# EAGLE design VentaConnected_Arduino_V0.01_2017-11-21_VorAutoRouting (EAGLE 8.3.2)
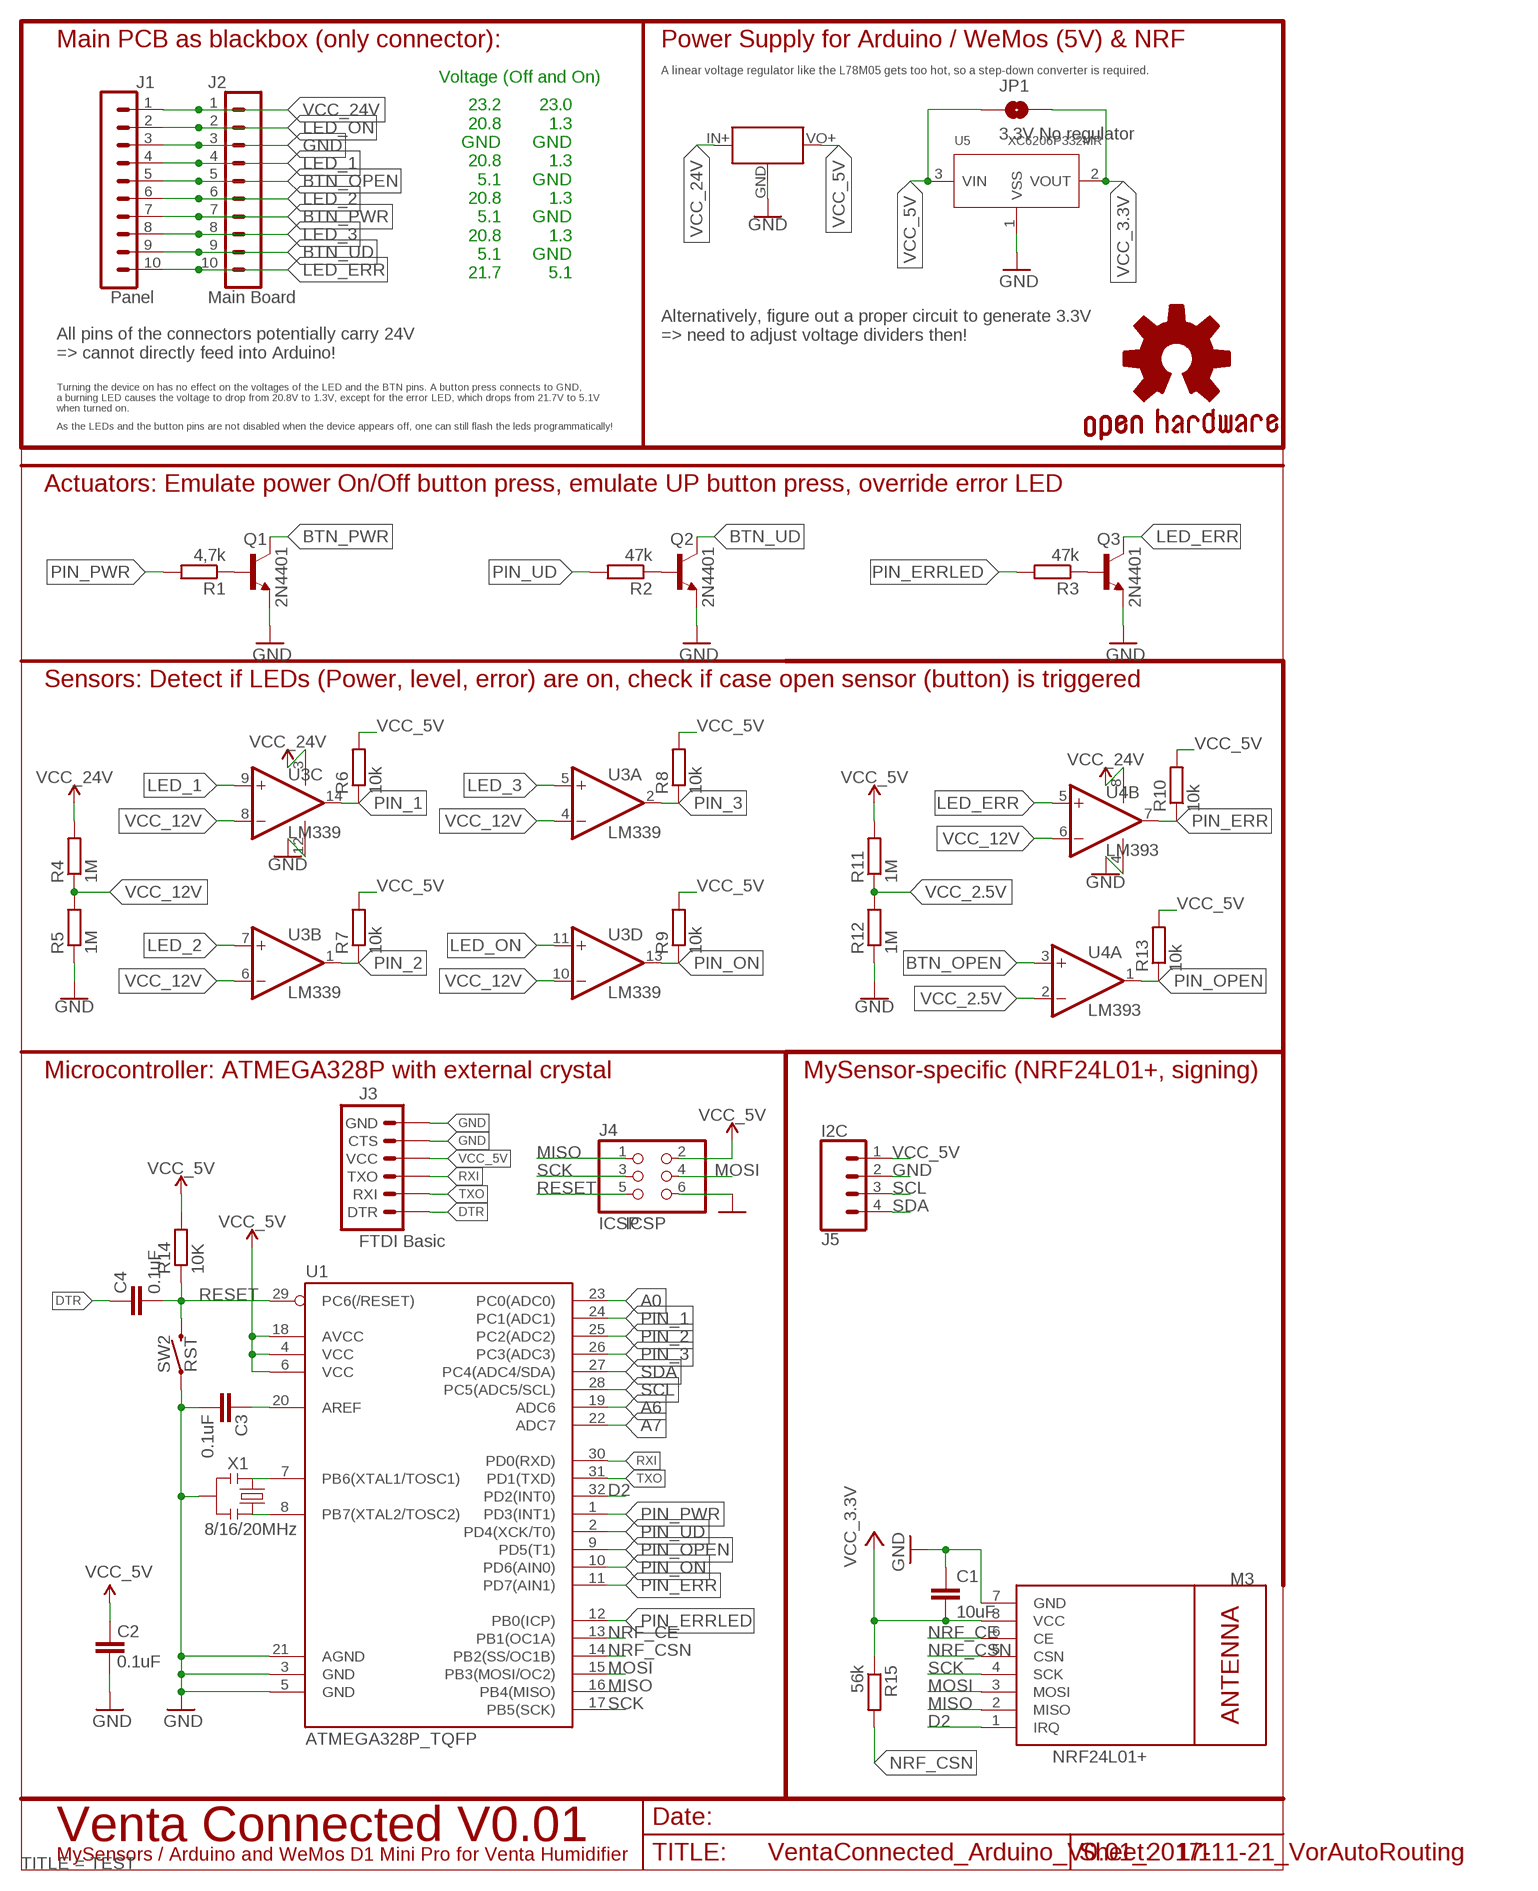
[diagram p0: schematic, sheet 1]
FRAME3 (A4-SMALL-DOCFIELD): TITLE: TEST

## Parts
C1  10uF  C-EUC0805  [C0805]
C2  0.1uF  CAP0805  [0805]
C3  0.1uF  CAP0805  [0805]
C4  0.1uF  CAP0805  [0805]
GOLD_ORB_SM1  OSHWLOGO_GOLD_ORB_SM  [OSHW2]
J1  Panel  CONN_05X2SHD  [2X5-SHROUDED]
J2  Main Board  CONN_05X2PTH  [2X5]
J3  FTDI Basic  ARDUINO_SERIAL_PROGRAMPTH  [1X06]
J4  ICSP  PINHD-2X3  [2X03]
J5  I2C  CONN_04  [1X04]
JP1  3.3V No regulator  JUMPER-SMT_2_NO_SILK  [SMT-JUMPER_2_NO_SILK]
M3  NRF24L01+  WIRELESS-NRF24L01SMD  [WIRELESS-NRF24L01-SMD]
Q1  2N4401  MMBT4401LT1-NPN-SOT23-BEC  [SOT23-BEC]
Q2  2N4401  MMBT4401LT1-NPN-SOT23-BEC  [SOT23-BEC]
Q3  2N4401  MMBT4401LT1-NPN-SOT23-BEC  [SOT23-BEC]
R1  4,7k  R-EU_R0805  [R0805]
R2  47k  R-EU_R0805  [R0805]
R3  47k  R-EU_R0805  [R0805]
R4  1M  R-EU_R0805  [R0805]
R5  1M  R-EU_R0805  [R0805]
R6  10k  R-EU_R0805  [R0805]
R7  10k  R-EU_R0805  [R0805]
R8  10k  R-EU_R0805  [R0805]
R9  10k  R-EU_R0805  [R0805]
R10  10k  R-EU_R0805  [R0805]
R11  1M  R-EU_R0805  [R0805]
R12  1M  R-EU_R0805  [R0805]
R13  10k  R-EU_R0805  [R0805]
R14  10K  R-EU_R0805  [R0805]
R15  56k  R-EU_R0805  [R0805]
SW2  RST  MOMENTARY-SWITCH-SPST-SMD-6.0X3.5MM  [TACTILE_SWITCH_SMD_6.0X3.5MM]
U1  ATMEGA328P_TQFP  [TQFP32-08]
U2  MINI_BUCK_CONVERTER_UPSIDEDOWN  [MINI_BUCK_CONVERTER_UPDOWN]
U3  LM339  TLC339D  [SO14]
U4  LM393  LM393D  [SO08]
U5  XC6206P332MR  PMIC-LDO-XC6206P332MR-G(SOT23)  [SOT-23]
X1  8/16/20MHz  RESONATOR1:1  [RESONATOR-SMD-1:1]

## Nets
A0: U1.23(PC0(ADC0))
A6: U1.19(ADC6)
A7: U1.22(ADC7)
AREF: C3.2 U1.20(AREF)
BTN_OPEN: J1.5 J2.5 U4.3(A:+IN)
BTN_PWR: J1.7 J2.7 Q1.C
BTN_UD: J1.9 J2.9 Q2.C
D2: M3.1(IRQ) U1.32(PD2(INT0))
DTR: C4.2 J3.1(DTR)
GND: C1.1 C2.1 C3.1 J1.3 J2.3 J3.5(CTS) J3.6(GND) J4.6 J5.2 M3.7(GND) Q1.E Q2.E Q3.E R5.1 R12.1 SW2.1 U1.3(GND) U1.5(GND) U1.21(AGND) U2.GND U3.12(P:V-) U4.4(P:V-) U5.1(VSS) X1.2
LED_1: J1.4 J2.4 U3.9(C:+IN)
LED_2: J1.6 J2.6 U3.7(B:+IN)
LED_3: J1.8 J2.8 U3.5(A:+IN)
LED_ERR: J1.10 J2.10 Q3.C U4.5(B:+IN)
LED_ON: J1.2 J2.2 U3.11(D:+IN)
MISO: J4.1 M3.2(MISO) U1.16(PB4(MISO))
MOSI: J4.4 M3.3(MOSI) U1.15(PB3(MOSI/OC2))
N$2: Q1.B R1.1
N$5: Q3.B R3.1
N$6: Q2.B R2.1
N$12: U1.8(PB7(XTAL2/TOSC2)) X1.3
N$13: U1.7(PB6(XTAL1/TOSC1)) X1.1
NRF_CE: M3.6(CE) U1.13(PB1(OC1A))
NRF_CSN: M3.5(CSN) R15.2 U1.14(PB2(SS/OC1B))
PIN_1: R6.1 U1.24(PC1(ADC1)) U3.14(C:OUT)
PIN_2: R7.1 U1.25(PC2(ADC2)) U3.1(B:OUT)
PIN_3: R8.1 U1.26(PC3(ADC3)) U3.2(A:OUT)
PIN_ERR: R10.1 U1.11(PD7(AIN1)) U4.7(B:OUT)
PIN_ERRLED: R3.2 U1.12(PB0(ICP))
PIN_ON: R9.1 U1.10(PD6(AIN0)) U3.13(D:OUT)
PIN_OPEN: R13.1 U1.9(PD5(T1)) U4.1(A:OUT)
PIN_PWR: R1.2 U1.1(PD3(INT1))
PIN_UD: R2.2 U1.2(PD4(XCK/T0))
RESET: C4.1 J4.5 R14.1 SW2.2 U1.29(PC6(/RESET))
RXI: J3.3(TXO) U1.30(PD0(RXD))
SCK: J4.3 M3.4(SCK) U1.17(PB5(SCK))
SCL: J5.3 U1.28(PC5(ADC5/SCL))
SDA: J5.4 U1.27(PC4(ADC4/SDA))
TXO: J3.2(RXI) U1.31(PD1(TXD))
VCC_2.5V: R11.1 R12.2 U4.2(A:-IN)
VCC_3.3V: C1.2 JP1.2 M3.8(VCC) R15.1 U5.2(VOUT)
VCC_5V: C2.2 J3.4(VCC) J4.2 J5.1 JP1.1 R6.2 R7.2 R8.2 R9.2 R10.2 R11.2 R13.2 R14.2 U1.4(VCC) U1.6(VCC) U1.18(AVCC) U2.VO+(VOUT) U5.3(VIN)
VCC_12V: R4.1 R5.2 U3.4(A:-IN) U3.6(B:-IN) U3.8(C:-IN) U3.10(D:-IN) U4.6(B:-IN)
VCC_24V: J1.1 J2.1 R4.2 U2.IN+(VIN) U3.3(P:V+) U4.8(P:V+)

## Notes on the sheet
- Main PCB as blackbox (only connector): | Power Supply for Arduino / WeMos (5V) & NRF
- A linear voltage regulator like the L78M05 gets too hot, so a step-down converter is required.
- Voltage (Off and On)
- 23.2
  20.8
  GND
  20.8
  5.1
  20.8
  5.1
  20.8
  5.1
  21.7
- 23.0
  1.3
  GND
  1.3
  GND
  1.3
  GND
  1.3
  GND
  5.1
- Alternatively, figure out a proper circuit to generate 3.3V 
  => need to adjust voltage dividers then!
- All pins of the connectors potentially carry 24V 
  => cannot directly feed into Arduino!
- Turning the device on has no effect on the voltages of the LED and the BTN pins. A button press connects to GND, 
  a burning LED causes the voltage to drop from 20.8V to 1.3V, except for the error LED, which drops from 21.7V to 5.1V 
  when turned on.
- As the LEDs and the button pins are not disabled when the device appears off, one can still flash the leds programmatically!
- Actuators: Emulate power On/Off button press, emulate UP button press, override error LED
- Sensors: Detect if LEDs (Power, level, error) are on, check if case open sensor (button) is triggered
- Microcontroller: ATMEGA328P with external crystal | MySensor-specific (NRF24L01+, signing)
- ICSP
- Venta Connected V0.01
- MySensors / Arduino and WeMos D1 Mini Pro for Venta Humidifier

## Library data of the parts
C1 = rcl:C-EU: CAPACITOR, European symbol
C2-C4 = SparkFun:CAP: Capacitor Standard 0603 ceramic capacitor, and 0.1" leaded capacitor.
GOLD_ORB_SM1 = bfl:OSHWLOGO: These are Open-Source Hardware logos.
J1 = opentools-connectors:CONN_05X2: Multi connection point. Often used as Generic Header-pin footprint for 0.1 inch spaced/style header connections For AVR SPI programming port, see special device with nice symbol: "AVR_SPI_PROG_5x2.dev" You can populate with any combo of single row headers, but if you'd like an exact match, check these: 2x5 AVR ICSP Male Header <https://www.sparkfun.com/products/778> (PRT-00778) 2x5 Pin Shrouded Header <https://www.sparkfun.com/products/8506> (PRT-08506) On any of the 0.1 inch spaced packages, you can populate with these: Break Away Headers - Straight <https://www.sparkfun.com/products/116> (PRT-00116) Break Away Male Headers - Right Angle <https://www.sparkfun.com/products/553> (PRT-00553) Female Headers <https://www.sparkfun.com/products/115> (PRT-00115) Break Away Headers - Machine Pin <https://www.sparkfun.com/products/117> (PRT-00117) Break Away Female Headers - Swiss Machine Pin <https://www.sparkfun.com/products/743> (PRT-00743) Special note: the shrouded connector mates well with our 5x2 ribbon cables: 2x5 Pin IDC Ribbon Cable <https://www.sparkfun.com/products/8535> (PRT-08535); PROD_ID: CONN-08671; SF_ID: PRT-08506
J2 = opentools-connectors:CONN_05X2: Multi connection point. Often used as Generic Header-pin footprint for 0.1 inch spaced/style header connections For AVR SPI programming port, see special device with nice symbol: "AVR_SPI_PROG_5x2.dev" You can populate with any combo of single row headers, but if you'd like an exact match, check these: 2x5 AVR ICSP Male Header <https://www.sparkfun.com/products/778> (PRT-00778) 2x5 Pin Shrouded Header <https://www.sparkfun.com/products/8506> (PRT-08506) On any of the 0.1 inch spaced packages, you can populate with these: Break Away Headers - Straight <https://www.sparkfun.com/products/116> (PRT-00116) Break Away Male Headers - Right Angle <https://www.sparkfun.com/products/553> (PRT-00553) Female Headers <https://www.sparkfun.com/products/115> (PRT-00115) Break Away Headers - Machine Pin <https://www.sparkfun.com/products/117> (PRT-00117) Break Away Female Headers - Swiss Machine Pin <https://www.sparkfun.com/products/743> (PRT-00743) Special note: the shrouded connector mates well with our 5x2 ribbon cables: 2x5 Pin IDC Ribbon Cable <https://www.sparkfun.com/products/8535> (PRT-08535); PROD_ID: CONN-08499; SF_ID: PRT-0778
J3 = SparkFun:ARDUINO_SERIAL_PROGRAM
J4 = analyzer:PINHD-2X3
J5 = SparkFun-Connectors:CONN_04: Multi connection point. Often used as Generic Header-pin footprint for 0.1 inch spaced/style header connections On any of the 0.1 inch spaced packages, you can populate with these: Break Away Headers - Straight <https://www.sparkfun.com/products/116> (PRT-00116) Break Away Male Headers - Right Angle <https://www.sparkfun.com/products/553> (PRT-00553) Female Headers <https://www.sparkfun.com/products/115> (PRT-00115) Break Away Headers - Machine Pin <https://www.sparkfun.com/products/117> (PRT-00117) Break Away Female Headers - Swiss Machine Pin <https://www.sparkfun.com/products/743> (PRT-00743) For SCREWTERMINALS and SPRING TERMINALS visit here: Screw Terimnals on SparkFun.com <https://www.sparkfun.com/search/results?term=Screw+Terminals> (5mm/3.5mm/2.54mm spacing) This device is also useful as a general connection point to wire up your design to another part of your project. Our various solder wires solder well into these plated through hole pads. Hook-Up Wire - Assortment (Stranded, 22 AWG) <https://www.sparkfun.com/products/11375> (PRT-11375) Hook-Up Wire - Assortment (Solid Core, 22 AWG) <https://www.sparkfun.com/products/11367> (PRT-11367) View the entire wire category on our website here <https://www.sparkfun.com/categories/141> Special notes: Molex polarized connector foot print use with SKU : PRT-08231 with associated crimp pins and housings. 1MM SMD Version SKU: PRT-10208; PROD_ID: CONN-09696
JP1 = SparkFun-Jumpers:JUMPER-SMT_2_NO: Normally open jumper This jumper has two pads in close proximity to each other. Apply solder to close the connection. Round pads are easier to solder for beginners, but are a lot larger. SparkFun Product that uses the round pads: SparkFun EL Sequencer <https://www.sparkfun.com/products/12781>
M3 = nrf24l01plus:WIRELESS-NRF24L01: 2.4 GHz Wireless Module based on NRF24L01 chip
Q1-Q3 = transistor-neu-to92:*-NPN-: NPN Transistror
R1-R5 R11 R12 = resistor:R-EU_: RESISTOR, European symbol
R6-R10 R13-R15 = rcl:R-EU_: RESISTOR, European symbol
SW2 = SparkFun-Switches:MOMENTARY-SWITCH-SPST: Momentary Switch (Pushbutton) - SPST Normally-open (NO) SPST momentary switches (buttons, pushbuttons). Variants PTH-12MM - 12mm square, through-hole Momentary Pushbutton Switch - 12mm Square <https://www.sparkfun.com/products/9190> (COM-09190) PTH-6.0MM, PTH-6.0MM-KIT - 6.0mm square, through-hole Mini Pushbutton Switch <https://www.sparkfun.com/products/97> (COM-00097) KIT package intended for soldering kit's - only one side of pads' copper is exposed. PTH-RIGHT-ANGLE-KIT - Right-angle, through-hole Right Angle Tactile Button <https://www.sparkfun.com/products/10791> - Used on SparkFun BigTime Watch Kit <https://www.sparkfun.com/products/11734> SMD-12MM - 12mm square, surface-mount Tactile Button - SMD (12mm) <https://www.sparkfun.com/products/12993> (COM-12993) Used on SparkFun PicoBoard <https://www.sparkfun.com/products/11888> SMD-4.5MM - 4.5mm Square Trackball Switch Used on SparkFun Blackberry Trackballer Breakout <https://www.sparkfun.com/products/13169> SMD-4.6MMX2.8MM - 4.60mm x 2.80mm, surface mount Used on SparkFun SAMD21 Mini Breakout <https://www.sparkfun.com/products/13664> SMD-5.2MM, SMD-5.2-REDUNDANT - 5.2mm square, surface-mount Mini Pushbutton Switch - SMD <https://www.sparkfun.com/products/8720> (COM-08720) Used on Arduino Pro Mini <https://www.sparkfun.com/products/11114> REDUNDANT package connects both switch circuits together SMD-6.0X3.5MM - 6.0 x 3.5mm, surface mount Momentary Reset Switch SMD <https://www.sparkfun.com/products/8229> (COM-08229) SMD-6.2MM-TALL - 6.2mm square, surface mount Tactile Button - SMD (6mm) <https://www.sparkfun.com/products/12992> Used on SparkFun Digital Sandbox <https://www.sparkfun.com/products/12651> SMD-RIGHT-ANGLE - Right-angle, surface mount Used on SparkFun Block for Intel® Edison - Arduino <https://www.sparkfun.com/products/13036>; PROD_ID: SWCH-00815; SF_SKU: COM-08229
U1 = SparkFun-IC-Microcontroller:ATMEGA328P_TQFP: Popular 328P in QFP Storefront component: ATmega328 - TQFP <https://www.sparkfun.com/products/13448> (COM-13448) Datasheet <http://www.sparkfun.com/datasheets/Components/SMD/ATMega328.pdf> SparkFun Products SparkFun RedBoard - Programmed with Arduino <https://www.sparkfun.com/products/12757> (DEV-12757) Arduino Pro Mini 328 - 5V/16MHz <https://www.sparkfun.com/products/11113> (DEV-11113) Arduino Pro Mini 328 - 3.3V/8MHz <https://www.sparkfun.com/products/11114> (DEV-11114) SparkFun OpenLog <https://www.sparkfun.com/products/13712> (DEV-13712) SparkFun MicroView - OLED Arduino Module <https://www.sparkfun.com/products/12923> (DEV-12923) SparkFun Digital Sandbox <https://www.sparkfun.com/products/12651> (DEV-12651) SparkFun PicoBoard <https://www.sparkfun.com/products/11888> (WIG-11888) Arduino Fio <https://www.sparkfun.com/products/10116> (DEV-10116) LilyPad Arduino 328 Main Board <https://www.sparkfun.com/products/13342> (DEV-13342) SparkFun RedStick <https://www.sparkfun.com/products/13741> (DEV-13741) LilyPad MP3 <https://www.sparkfun.com/products/11013> (DEV-11013) LilyPad Arduino SimpleSnap <https://www.sparkfun.com/products/10941> (DEV-10941) SparkFun Stepoko <https://www.sparkfun.com/products/13899> (ROB-13899) SparkFun Geiger Counter <https://www.sparkfun.com/products/11345> (SEN-11345) SparkFun EL Sequencer <https://www.sparkfun.com/products/12781> (COM-12781) Arduino Pro 328 - 5V/16MHz <https://www.sparkfun.com/products/10915> (DEV-10915) CryptoCape <https://www.sparkfun.com/products/12773> (DEV-12773) SparkFun IR Thermometer Evaluation Board - MLX90614 <https://www.sparkfun.com/products/10740> (SEN-10740) SparkFun RedBot Mainboard <https://www.sparkfun.com/products/12097> (ROB-12097) Arduino Pro 328 - 3.3V/8MHz <https://www.sparkfun.com/products/10914> (DEV-10914) SparkFun Block for Intel® Edison - Arduino <https://www.sparkfun.com/products/13036> (DEV-13036) SparkFun Simon Says - Surface Mount Soldering Kit <https://www.sparkfun.com/products/10935> (KIT-10935) SparkFun 7-Segment Serial Display - Red <https://www.sparkfun.com/products/11441> (COM-11441) SparkFun 7-Segment Serial Display - White <https://www.sparkfun.com/products/11629> (COM-11629) SparkFun 7-Segment Serial Display - Yellow <https://www.sparkfun.com/products/11443> (COM-11443) SparkFun 7-Segment Serial Display - Kelly Green <https://www.sparkfun.com/products/11440> (COM-11440) SparkFun 7-Segment Serial Display - Blue <https://www.sparkfun.com/products/11442> (COM-11442) SparkFun OpenSegment Serial Display - 20mm (Blue) <https://www.sparkfun.com/products/11647> (COM-11647) SparkFun OpenSegment Serial Display - 20mm (Green) <https://www.sparkfun.com/products/11646> (COM-11646) SparkFun OpenSegment Serial Display - 20mm (White) <https://www.sparkfun.com/products/11648> (COM-11648) SparkFun OpenSegment Serial Display - 20mm (Red) <https://www.sparkfun.com/products/11644> (COM-11644) SparkFun OpenSegment Serial Display - 20mm (Yellow) <https://www.sparkfun.com/products/11645> (COM-11645) SparkFun OpenSegment Shield <https://www.sparkfun.com/products/13190> (DEV-13190); PROD_ID: IC-09069
U2 = opentools-sensors:MINI_BUCK_CONVERTER: 4.5-40V Step Down Buck Converter
U3 = linear:TLC339: COMPARATOR
U4 = linear:LM393: COMPARATOR
U5 = Seeed-IC:PMIC-LDO-XC6206P332MR-G(SOT23): 310030099; MPN: XC6206P332MR-G; VALUE: XC6206P332MR-G-SOT23
X1 = Testing:RESONATOR: Resonator Small SMD resonator. This is the itty bitty 10/20MHz resonators with built in caps. CSTCE10M0G55 and CSTCE20M0V53. Footprint for SMD has been used in SFE production for years, and does work okay. 1:1 is an attempt to get larger fillets on the sides so it will be easier to inspect these solders in our AOI machine. The pads have been minimized to match the actual metal under the resonator. To see this relation, it includes an image import of the bottom side of the component. Imported to scale on layer 200.

## Net classes
0 default: width 0.203 mm
1 vcc: width 0.254 mm

## Board
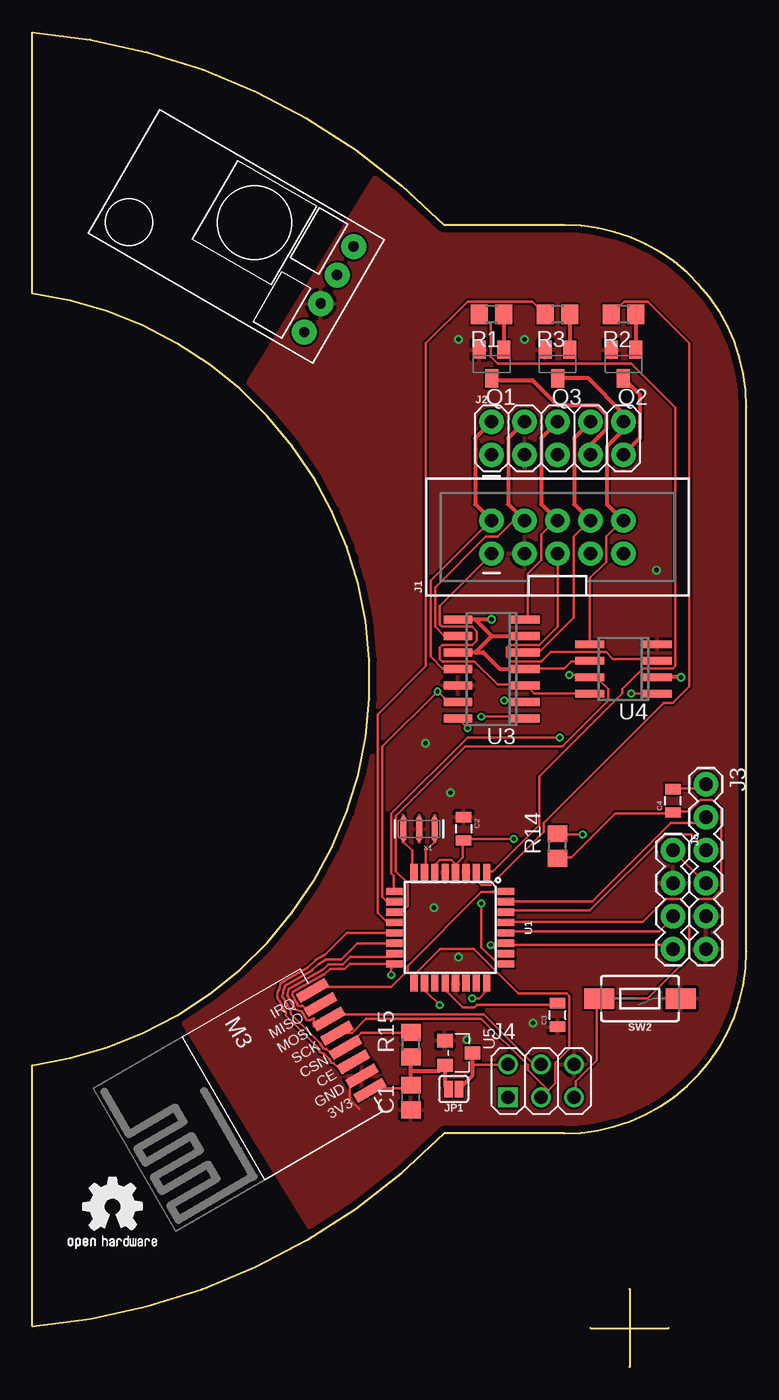
[diagram p1: board, top side]
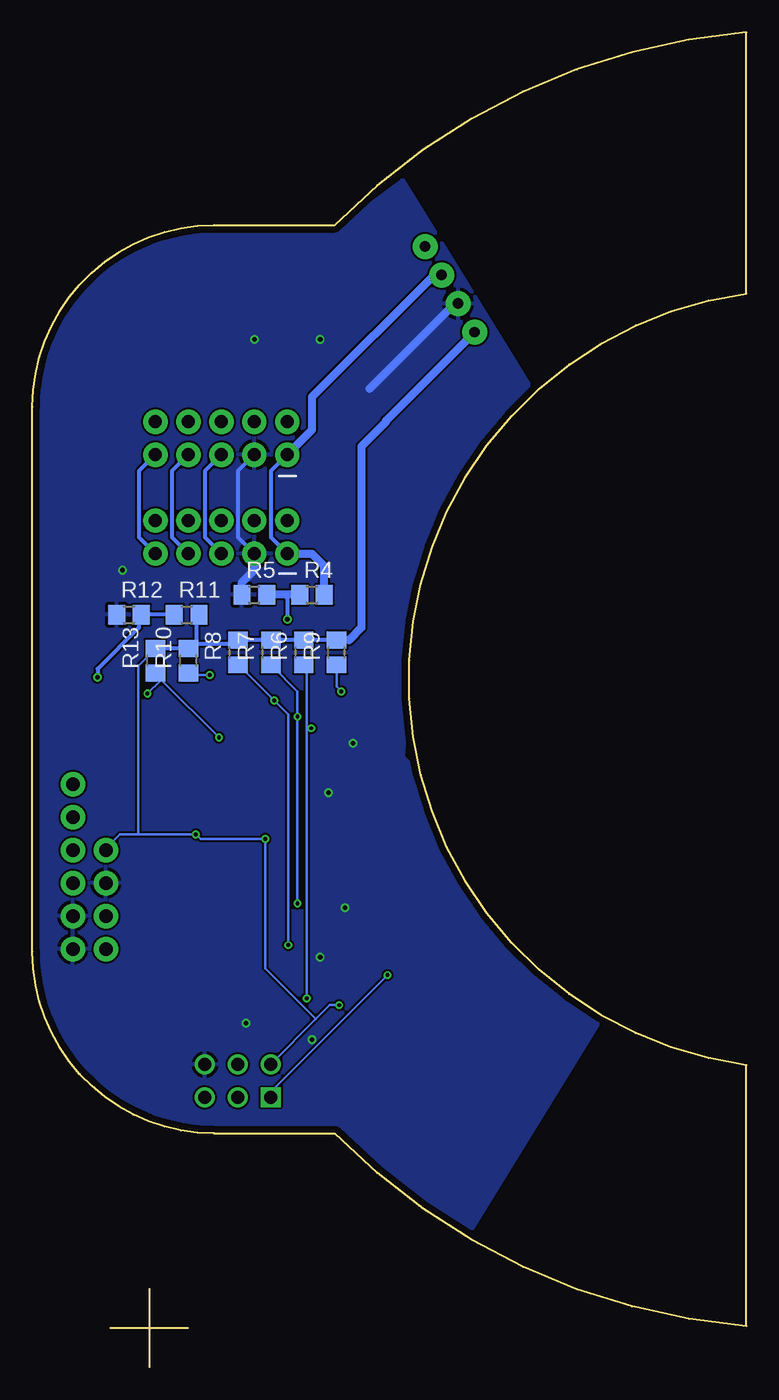
[diagram p2: board, bottom side, seen from below]

Size 55 x 102.85 mm. Coordinates in mm from the lower left corner, seen from the top.
Outline: 46,6 46,0
Outline: 43,3 49,3
Outline: 41,18 arc90 55,32 55,74 arc90 41,88 31.71,88 arc41 0,102.85 0,82.73 arc-165 0,23.27 0,3.16 arc41 31.71,18 41,18
Copper layers (1*16): Top 0.035mm / dielectric 1.6mm / Bottom 0.035mm
Design rules "Elecrow_2-layer_PCB_eagle_rule": minimum track width 6mil, minimum drill 12mil, track to track 6mil, track to pad 6mil, pad to pad 6mil, via to via 8mil, smd to smd 0mil, copper to edge 20mil, drill to drill 10mil, minimum pad ring 6mil, minimum via ring 6mil, stop-mask expansion 0mil, vias tented up to drill 100mil, thermal gap 10mil

### Footprints (pad centres in the part's own frame; a part is rotated, then mirrored left to right if it is on the bottom)
C0805 = smd 1.3 x 1.5: 1 -0.95,0; 2 0.95,0
0805 = smd 0.8 x 1.2: 1 -0.9,0; 2 0.9,0
2X5-SHROUDED = drill 1.016 pad 1.88: 1 -1.27,5.08; 2 1.27,5.08; 3 -1.27,2.54; 4 1.27,2.54; 5 -1.27,0; 6 1.27,0; 7 -1.27,-2.54; 8 1.27,-2.54; 9 -1.27,-5.08; 10 1.27,-5.08
2X5 = drill 1.016 pad 1.88: 1 0,0; 2 0,2.54; 3 2.54,0; 4 2.54,2.54; 5 5.08,0; 6 5.08,2.54; 7 7.62,0; 8 7.62,2.54; 9 10.16,0; 10 10.16,2.54
1X06 = drill 1.016 pad 1.88: 1 0,0; 2 2.54,0; 3 5.08,0; 4 7.62,0; 5 10.16,0; 6 12.7,0
2X03 = drill 1.016 square: 1 -2.54,-1.27 | drill 1.016: 2 -2.54,1.27; 3 0,-1.27; 4 0,1.27; 5 2.54,-1.27; 6 2.54,1.27
1X04 = drill 1.016 pad 1.88: 1 0,0; 2 2.54,0; 3 5.08,0; 4 7.62,0
SMT-JUMPER_2_NO_SILK = smd 0.635 x 1.27: 1 -0.406,0; 2 0.406,0
WIRELESS-NRF24L01-SMD = smd 2.54 x 0.762: 1 1.27,0; 2 1.27,1.27; 3 1.27,2.54; 4 1.27,3.81; 5 1.27,5.08; 6 1.27,6.35; 7 1.27,7.62; 8 1.27,8.89
SOT23-BEC = smd 1 x 1.4: B -0.95,-1.1; C 0,1.1; E 0.95,-1.1
R0805 = smd 1.3 x 1.5: 1 -0.95,0; 2 0.95,0
TACTILE_SWITCH_SMD_6.0X3.5MM = smd 2.3 x 1.6: 1 -3.15,0; 2 3.15,0
TQFP32-08 = smd 1.27 x 0.559: 1 -4.293,2.8; 2 -4.293,2; 3 -4.293,1.2; 4 -4.293,0.4; 5 -4.293,-0.4; 6 -4.293,-1.2; 7 -4.293,-2; 8 -4.293,-2.8; 17 4.293,-2.8; 18 4.293,-2; 19 4.293,-1.2; 20 4.293,-0.4; 21 4.293,0.4; 22 4.293,1.2; 23 4.293,2; 24 4.293,2.8 | smd 0.559 x 1.27: 9 -2.8,-4.293; 10 -2,-4.293; 11 -1.2,-4.293; 12 -0.4,-4.293; 13 0.4,-4.293; 14 1.2,-4.293; 15 2,-4.293; 16 2.8,-4.293; 25 2.8,4.293; 26 2,4.293; 27 1.2,4.293; 28 0.4,4.293; 29 -0.4,4.293; 30 -1.2,4.293; 31 -2,4.293; 32 -2.8,4.293
MINI_BUCK_CONVERTER_UPDOWN = drill 0.8 pad 1.93: EN -1.27,1.27; GND -6.35,1.27; IN+ -3.81,1.27; VO+ -8.89,1.27
SO14 = smd 0.6 x 2.2: 1 -3.81,-2.6; 2 -2.54,-2.6; 3 -1.27,-2.6; 4 0,-2.6; 5 1.27,-2.6; 6 2.54,-2.6; 7 3.81,-2.6; 8 3.81,2.6; 9 2.54,2.6; 10 1.27,2.6; 11 0,2.6; 12 -1.27,2.6; 13 -2.54,2.6; 14 -3.81,2.6
SO08 = smd 0.6 x 2.2: 1 -1.905,-2.6; 2 -0.635,-2.6; 3 0.635,-2.6; 4 1.905,-2.6; 5 1.905,2.6; 6 0.635,2.6; 7 -0.635,2.6; 8 -1.905,2.6
SOT-23 = smd 1.016 x 1.2: 1 -0.95,-1.06; 2 0.95,-1.06; 3 0,1.06
RESONATOR-SMD-1:1 = smd 0.45 x 1.905: 1 -1.2,0; 2 0,0; 3 1.2,0

### Placement (x,y rotation side)
C1  29.15,20.78 90 top
C2  33.21,41.48 270 top
C3  40.45,27.13 90 top
C4  49.34,43.64 90 top
GOLD_ORB_SM1  2.35,8.08 0 top
J1  40.45,63.96 90 top
J2  35.37,70.31 0 top
J3  51.88,44.91 270 top
J4  39.18,22.05 0 top
J5  49.34,39.83 270 top
JP1  32.45,21.41 180 top
M3  22.67,29.67 210 top
Q1  35.37,77.3 180 top
Q2  45.53,77.3 180 top
Q3  40.45,77.3 180 top
R1  35.37,81.11 180 top
R2  45.53,81.11 180 top
R3  40.45,81.11 180 top
R4  33.47,59.52 0 bottom
R5  37.91,59.52 0 bottom
R6  34.1,55.07 90 bottom
R7  36.64,55.07 90 bottom
R8  39.18,55.07 90 bottom
R9  31.56,55.07 90 bottom
R10  42.99,54.44 90 bottom
R11  43.12,57.99 0 bottom
R12  47.56,57.99 0 bottom
R13  45.53,54.44 90 bottom
R14  40.45,40.15 90 top
R15  29.15,24.84 90 top
SW2  46.8,28.4 180 top
U1  32.2,33.86 270 top
U2  26.48,86.82 60 top
U3  35.37,53.8 90 top
U4  45.53,53.8 90 top
U5  32.83,24.21 270 top
X1  29.78,41.48 180 top

### Tracks (layer width: path | path; a pad name or v marks a point on that pad's centre or on a via)
AREF
  Top 0.203: C3.2 40.45,27.89 34.23,27.89 34.05,27.71 33.16,27.71 31.92,28.96 31.92,29.49 U1.20
BTN_OPEN
  Top 0.203: J1.5 40.45,57.05 39.03,55.63 36.72,55.63 36.54,55.45 36.54,54.74 36.89,54.38 39.2,54.38 39.92,55.09 44.18,55.09 44.72,54.56 48.09,54.56 U4.3
  Bottom 0.305: J2.5 41.72,69.04 41.72,63.96 J1.5
BTN_PWR
  Top 0.305: Q1.C 35.54,76.03 38.55,76.03 40.48,74.09 43.51,74.09 44.23,73.37 44.23,72.33 42.99,71.09 J2.7
  Bottom 0.305: J2.7 44.26,69.04 44.26,63.96 J1.7
BTN_UD
  Top 0.305: 45.53,76.03 Q2.C 46.8,74.92 46.8,71.58 J2.9
  Bottom 0.305: J2.9 46.8,69.04 46.8,63.96 J1.9
D2
  Top 0.203: U1.32 36.36,36.6 34.58,36.6 28.89,30.91 28.89,30.56 27.65,29.31 21.78,29.31 21.6,29.14 M3.1
DTR
  Top 0.203: C4.2 49.34,44.6 51.65,44.6 51.83,44.78 J3.1
GND  (via drill 0.35)
  Top 0.203: 25.52,22.56 M3.7 25.34,22.38 24.45,21.49 24.45,20.6 25.16,19.89 | 49.87,28.25 SW2.1 | 29.07,19.89 C1.1
  Bottom 0.305: J2.3 39.18,69.04 39.18,63.96 J1.3
  Bottom 0.61: U2.GND 22.45,81.96 29.02,75.39 | J1.3 37.91,61.42 38.86,60.47 R5.1
  other vias: 32.83,79.2 37.91,79.2 48.07,61.42 32.83,31.57 33.47,25.23 38.55,26.5 30.92,35.38 32.2,44.27 30.29,48.09
  pour Top: 26.48,91.9 16.32,75.39 16.32,74.12 22.67,67.77 21.4,66.5 25.21,62.69 26.48,47.45 25.21,46.18 22.67,38.56 11.24,27.13 21.4,10.62 32.83,18.24 44.26,18.24 53.15,23.32 55.69,29.67 55.69,74.12 51.88,84.28 42.99,88.09 31.56,88.09
  pour Bottom: 26.48,91.52 16.32,75.01 16.32,73.74 22.67,67.39 21.4,66.12 25.21,62.31 26.48,47.07 25.21,45.8 22.67,38.18 11.24,26.75 21.4,10.24 32.83,17.86 44.26,17.86 53.15,22.94 55.69,29.29 55.69,73.74 51.88,83.9 42.99,87.71 31.56,87.71
LED_1
  Top 0.203: U3.9 31.74,56.34 31.03,57.05 31.03,60.07 34.94,63.98 35.83,63.98 37.43,65.59 J1.4
  Top 0.305: J2.4 36.64,71.58 36.64,66.5 J1.4
LED_2
  Top 0.203: U3.7 38.14,57.76 38.14,61.14 39.2,62.21 39.2,64.16 40.27,65.23 J1.6
  Top 0.305: J2.6 39.18,71.58 39.18,66.5 J1.6
LED_3
  Top 0.203: U3.5 38.14,55.09 39.03,55.09 41.7,57.76 41.7,63.98 42.94,65.23 J1.8
  Top 0.305: J2.8 41.72,71.58 41.72,66.5 J1.8
LED_ERR
  Top 0.203: U4.5 42.94,55.81 42.94,60.78 44.18,62.03 44.18,63.98 45.43,65.23 J1.10
  Top 0.305: J1.10 44.26,66.5 44.26,70.94 45.53,72.22 J2.10 45.53,73.48 42.82,76.19 Q3.C
LED_ON
  Top 0.203: U3.11 32.63,53.85 31.56,53.85 30.67,54.74 30.67,60.61 35.29,65.23 J1.2
  Top 0.305: J2.2 34.1,71.58 34.1,66.5 J1.2
MISO  (via drill 0.3)
  Top 0.203: 20.34,28.12 20.01,28.69 20.06,28.9 22.44,30.27 22.5,30.26 22.92,30.69 24.07,30.69 24.44,31.06 U1.16 27.65,31.09 v27.65,30.2 | 20.34,28.12 | 20.34,28.12 20.49,27.85 20.7,27.8 20.8,27.86 21.4,27.26 21.53,27.26 M3.2
  Bottom 0.203: v27.65,30.2 36.54,21.31 36.54,20.78 J4.1
MOSI
  Top 0.203: 20.26,27.55 20.46,27.49 20.48,27.47 20.75,27.4 21.13,26.75 21.33,26.7 21.65,26.88 21.65,26.24 22.25,26.84 M3.3 22.85,27 23.03,27.18 34.76,27.18 38.49,23.45 39.03,23.45 J4.4 | 20.26,27.55 | 20.26,27.55 | 20.26,27.55 20.11,27.8 20.05,27.9 19.98,27.97 19.98,28.02 19.96,28.07 19.77,28.39 | 19.77,28.39 | 19.77,28.39 19.63,28.64 | 19.63,28.64 | 19.63,28.64 | 19.63,28.64 19.68,28.85 | 19.68,28.85 | 19.68,28.85 19.76,29.13 21.77,30.3 21.78,30.3 22.39,30.66 22.78,31.04 23.92,31.04 24.47,31.59 27.64,31.59 U1.15
N$2
  Top 0.305: R1.1 Q1.B
N$5
  Top 0.305: R3.1 Q3.B
N$6
  Top 0.305: R2.1 Q2.B
N$12
  Top 0.203: U1.8 29.25,38.2 29.25,39.8 28.54,40.52 28.58,40.47
N$13
  Top 0.203: U1.7 30.31,38.2 30.31,39.8 31.03,40.52 30.98,40.47
NRF_CE
  Top 0.203: 21.17,30.77 | 21.17,30.77 | 21.17,30.77 19.53,29.82 19.36,29.72 19.3,29.72 19.23,29.65 19.15,29.6 19.13,29.55 19.09,29.51 19.09,29.48 19.04,29.27 19.02,29.16 18.99,29.01 18.91,28.94 18.86,28.77 18.86,28.59 18.87,28.57 18.86,28.54 18.87,28.53 18.86,28.49 18.89,28.45 18.89,28.39 18.96,28.26 19.06,28.17 19.1,28.09 19.11,28.08 19.12,28.06 | 19.12,28.06 | 19.12,28.06 | 19.12,28.06 19.13,28.06 19.19,27.88 | 19.19,27.88 | 19.19,27.88 | 21.17,30.77 21.26,30.82 21.78,31.35 21.87,31.4 22.48,31.75 22.53,31.78 24.21,33.46 U1.13 | 19.19,27.88 19.27,27.75 19.27,27.68 19.48,27.46 19.53,27.39 19.53,27.09 21.87,24.75 22.02,24.5 22.16,24.25 | 22.16,24.25 | 22.16,24.25 22.37,24.19 | 22.37,24.19 | 22.37,24.19 22.46,24.17 22.84,23.78 23.03,23.45 23.22,23.4 23.94,22.68 23.94,22.73 M3.6
NRF_CSN
  Top 0.203: U1.14 25.04,32.66 23.77,31.4 22.63,31.4 22.02,31.04 21.56,30.59 21.48,30.54 21.47,30.53 19.71,29.51 19.45,29.37 | 19.45,29.37 | 19.45,29.37 | 19.45,29.37 19.43,29.27 19.37,29.07 19.36,29.06 19.33,28.93 19.31,28.83 19.27,28.79 19.27,28.7 19.24,28.62 19.25,28.61 19.24,28.59 19.24,28.54 19.27,28.5 19.33,28.43 19.37,28.35 19.39,28.35 19.39,28.34 | 19.39,28.34 19.45,28.24 19.48,28.14 19.52,28.12 19.58,28.02 19.63,27.93 19.63,27.82 19.77,27.68 19.9,27.45 19.9,27.23 22.15,24.98 22.4,24.55 22.6,24.5 22.62,24.51 23.18,23.95 23.43,23.95 M3.5 24.27,24.69 25.34,25.76 29.07,25.76 R15.2 | 19.39,28.34 | 19.39,28.34
PIN_1  (via drill 0.3)
  Top 0.203: v33.87,28.43 34.41,28.43 34.94,28.96 34.94,29.49 U1.24 | v33.52,49.23 32.8,49.94 U3.14
  Bottom 0.203: 33.87,49.23 33.87,53.85 34.05,54.03 R6.1 | 33.87,49.23 v33.87,28.43 | 33.87,49.23 v33.52,49.23
PIN_2  (via drill 0.3)
  Top 0.203: v34.58,35.72 34.58,32.34 35.83,31.09 36.36,31.09 U1.25 | v34.58,50.12 37.96,50.12 U3.1
  Bottom 0.203: v34.58,35.72 v34.58,50.12 34.58,52.07 36.54,54.03 R7.1
PIN_3  (via drill 0.3)
  Top 0.203: v35.29,32.52 35.83,31.98 36.36,31.98 U1.26 | v36.36,51.36 37.96,51.36 U3.2
  Bottom 0.203: v35.29,32.52 35.29,50.3 v36.36,51.36 39.03,54.03 R8.1
PIN_ERR  (via drill 0.3)
  Top 0.203: U1.11 28,35.18 28.54,35.18 28.89,35.54 28.89,37.31 28,38.2 28,42.47 33.34,47.81 40.81,47.81 44.36,51.36 44.36,52.25 43.47,53.14 42.94,53.14 U4.7 42.76,53.32 v41.34,53.32
  Bottom 0.203: v41.34,53.32 42.94,53.32 R10.1
PIN_ERRLED
  Top 0.203: U1.12 27.83,34.29 27.29,34.29 26.58,35 26.58,50.3 30.31,54.03 30.31,78.92 33.52,82.12 38.49,82.12 39.38,81.23 R3.2
PIN_ON  (via drill 0.3)
  Top 0.203: 32.09,51.18 32.63,51.18 U3.13 32.09,51.18 | U1.10 27.83,35.89 27.29,35.89 26.94,36.25 26.94,47.81 v31.2,52.07 32.09,51.18
  Bottom 0.203: R9.1 31.56,52.43 v31.2,52.07
PIN_OPEN  (via drill 0.3)
  Top 0.203: v40.63,48.52 33.52,48.52 27.65,42.65 27.65,38.03 27.83,37.85 27.83,36.78 U1.9 | v46.14,51.9 U4.1
  Bottom 0.203: 45.07,52.96 45.43,53.32 R13.1 45.07,52.96 | 45.07,52.96 v40.63,48.52 | 45.07,52.96 v46.14,51.9
PIN_PWR
  Top 0.203: U1.1 35.12,38.2 35.47,38.2 39.03,41.76 39.03,45.49 45.43,51.9 45.43,52.25 47.03,53.85 49.34,53.85 49.52,54.03 49.52,73.94 46.14,77.32 35.83,77.32 35.29,77.85 35.29,80.34 34.58,81.05 R1.2
PIN_UD
  Top 0.203: U1.2 34.23,38.03 34.23,37.49 34.58,37.14 35.29,37.14 39.38,41.23 39.38,41.94 48.63,51.18 49.34,51.18 50.59,52.43 50.59,78.92 47.38,82.12 45.61,82.12 44.72,81.23 R2.2
RESET
  Top 0.203: R14.1 40.45,39.27 41.52,39.27 44.9,42.65 49.34,42.65 C4.1 49.34,42.83 50.59,42.83 51.47,43.72 52.36,43.72 53.07,43.01 53.07,36.78 52.36,36.07 51.3,36.07 50.59,35.36 | 50.59,35.36 49.87,36.07 48.81,36.07 47.03,34.29 36.54,34.29 U1.29 | 50.59,35.36 50.59,31.63 47.38,28.43 43.65,28.43 SW2.2 43.47,28.25 43.47,23.62 41.87,22.02 41.87,20.78 J4.5
RXI
  Top 0.203: U1.30 36.54,35.18 42.94,35.18 48.81,41.05 50.76,41.05 51.83,39.98 J3.3
SCK
  Top 0.203: 39.74,21.31 39.2,20.78 J4.3 | 39.74,21.31 40.27,21.85 40.27,23.45 41.34,24.51 41.34,28.6 41.16,28.78 37.43,28.78 34,32.21 31.43,32.21 29.43,30.2 29.43,29.67 U1.17 | 39.74,21.31 38.14,22.91 38.14,23.27 34.58,26.82 25.69,26.82 24.63,25.76 23.56,25.76 M3.4
SCL
  Top 0.203: U1.28 36.54,33.58 48.27,33.58 49.34,34.65 J5.3
SDA
  Top 0.203: U1.27 36.54,32.52 49.16,32.52 49.34,32.34 J5.4
TXO
  Top 0.203: U1.31 36.54,35.89 43.12,35.89 49.16,41.94 51.47,41.94 51.83,42.29 J3.2
VCC_2.5V  (via drill 0.35)
  Top 0.203: U4.2 48.27,53.14 48.27,53.16
  Top 0.305: v49.98,53.16 48.27,53.16 U4.2 48.07,53.16
  Bottom 0.305: R11.1 R12.2 46.8,57.8 46.8,56.98 49.98,53.8 v49.98,53.16
VCC_3.3V
  Top 0.203: M3.8 26.05,21.49 28.89,21.49 29.07,21.67 C1.2
  Top 0.305: JP1.2 31.77,21.69 U5.2 31.32,22.81 29.15,22.81 | C1.2 29.15,22.81 | 29.15,22.81 R15.1
VCC_5V  (via drill 0.3)
  Top 0.203: v31.38,27.89 30.31,28.96 30.31,29.49 U1.18 | 33.87,23.27 33.89,23.27 36.54,23.27 J4.2 | 32.63,38.74 33.16,39.27 33.16,40.52 C2.2 33.34,40.69 v37.07,40.69 | 32.63,38.74 32.63,38.2 U1.4 32.63,38.74 | 32.63,38.74 32.27,39.09 31.38,39.09 31.03,38.74 31.03,38.2 U1.6 | v42.41,41.05 40.45,41.05 R14.2 | J3.4 51.83,37.31 49.34,39.8 J5.1
  Top 0.305: U5.3 33.89,23.27 33.89,22.45 JP1.1
  Bottom 0.203: v31.38,27.89 32.09,27.89 33.16,26.82 | 33.16,26.82 36.54,23.45 J4.2 | 46.85,41.05 48.27,41.05 49.34,39.98 J5.1 | 46.85,41.05 v42.41,41.05 42.05,40.69 v37.07,40.69 37.07,30.74 33.16,26.82 | 46.85,41.05 46.85,54.03 45.61,55.27 R13.2
  Bottom 0.305: R9.2 R6.2 R7.2 R8.2 39.49,55.7 42.35,55.7 | R11.2 42.35,57.8 42.35,55.7 | 42.35,55.7 42.67,55.38 R10.2 R13.2
  Bottom 0.61: U2.VO+ 27.75,72.94 27.75,72.85 29.66,70.94 29.66,56.98 30.61,56.02 R9.2
VCC_12V  (via drill 0.35)
  Top 0.203: 34.23,57.61 34.23,57.59 34.18,57.53 | U3.4 38.14,53.85 40.98,53.85 41.52,54.38 42.76,54.38 U4.6
  Top 0.305: U3.8 34.1,57.61 34.18,57.53 35.37,56.34 | 35.37,56.34 U3.6 | 35.37,56.34 34.1,55.07 | 34.1,55.07 U3.10 | 34.1,55.07 34.73,55.07 36.01,53.8 U3.4 | v35.37,57.61 34.23,57.61 32.83,57.61
  Bottom 0.203: 35.37,59.36 35.47,59.36 35.47,59.52
  Bottom 0.305: 35.37,59.52 35.37,59.36 v35.37,57.61
  Bottom 0.61: R4.1 35.47,59.52 R5.2
VCC_24V
  Top 0.203: U4.8 38.67,51.9 38.14,52.43 U3.3 37.96,52.61 35.83,52.61 34.05,54.38 31.56,54.38 31.38,54.56 31.38,55.45 31.56,55.63 33.87,55.63 34.23,55.98 34.23,56.7 33.87,57.05 31.56,57.05 31.38,57.23 31.38,58.65 35.29,62.56 J1.1
  Bottom 0.305: J2.1 36.64,69.04 36.64,63.96 J1.1
  Bottom 0.61: U2.IN+ 23.6,84.28 23.94,84.28 33.47,74.75 33.47,72.22 J2.1 | R4.2 32.52,61.74 33.47,62.69 J1.1

### Text on the board
bOrigins: VentaConnected for atmega / R. Kainhofer / Version 0.001, 14. 11.2017